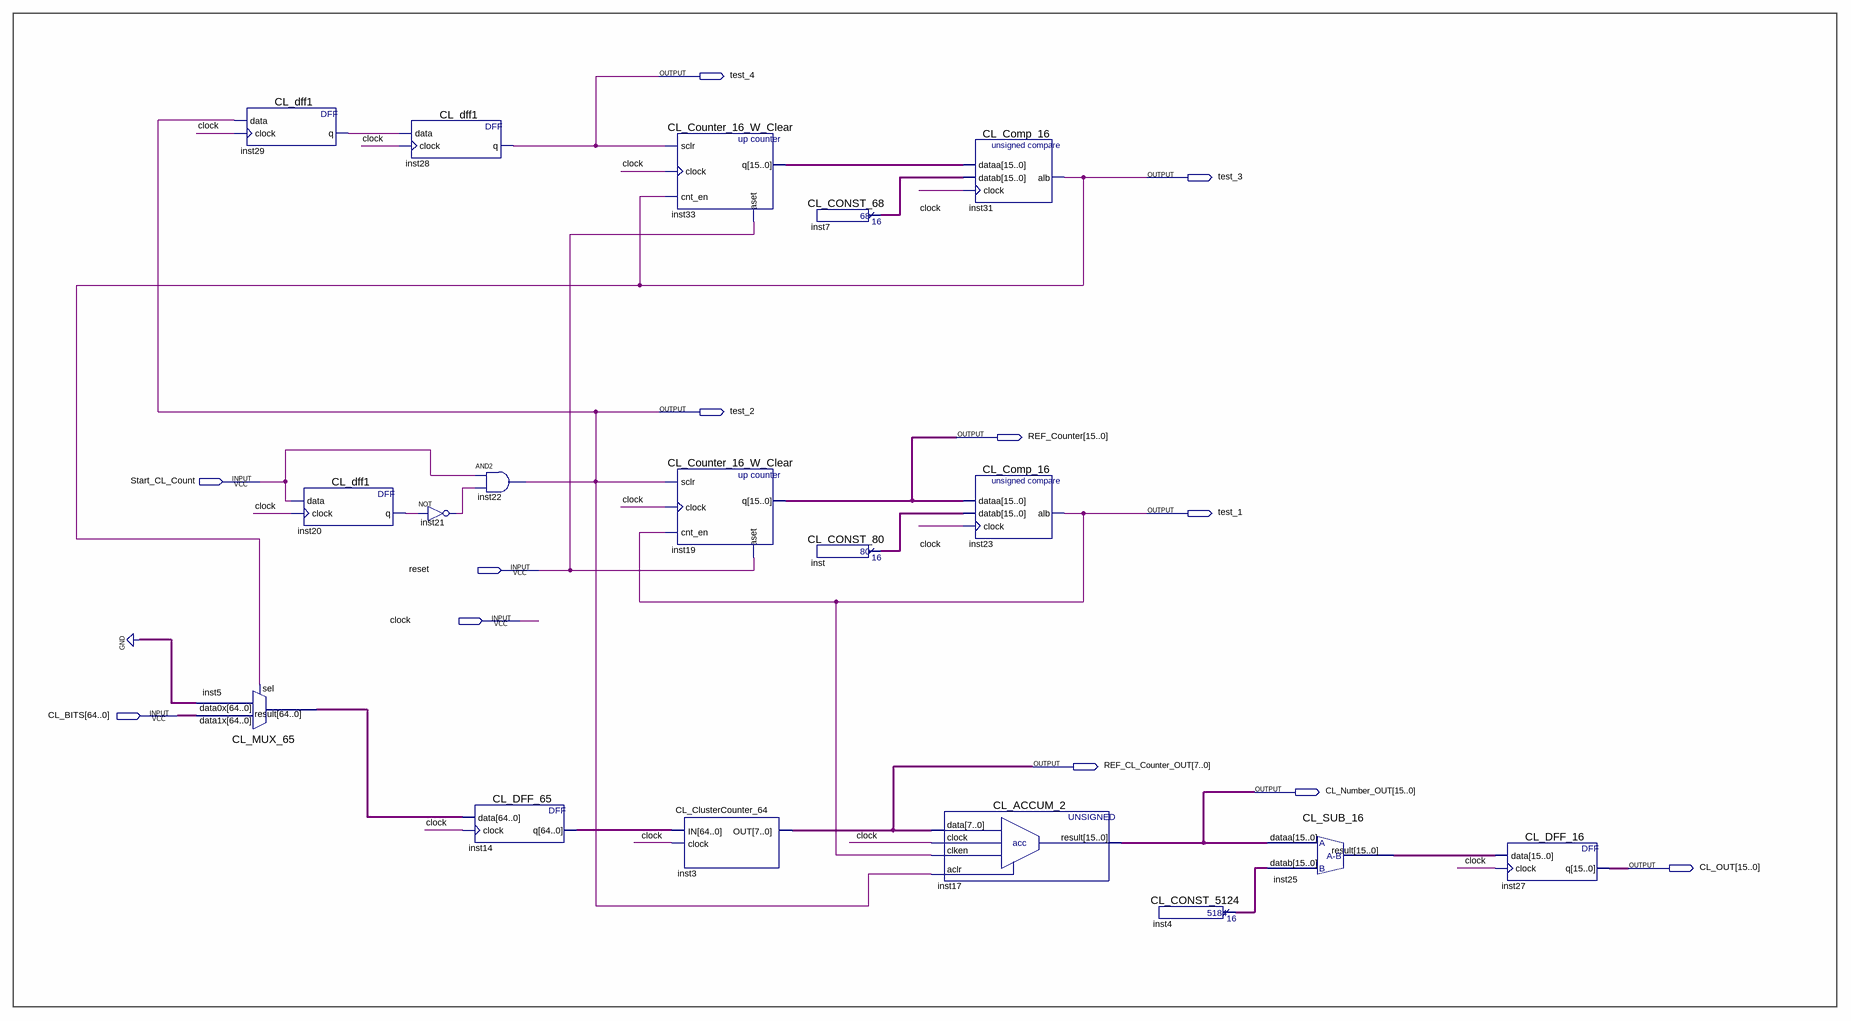
[diagram p0: schematic sheet]
// Quartus schematic CL_Block.bdf as structural Verilog: 18 symbols, 12 pins
module CL_Block (
  input  Start_CL_Count,
  input  reset,
  input  clock,
  input  [64:0] CL_BITS,
  output test_4,
  output test_3,
  output test_2,
  output [15:0] REF_Counter,
  output test_1,
  output [7:0] REF_CL_Counter_OUT,
  output [15:0] CL_Number_OUT,
  output [15:0] CL_OUT
);

  wire inst20_q, inst21_out, inst29_q;
  wire [15:0] inst4_result, inst7_result, inst25_result, inst33_q, inst_result;
  wire [64:0] inst5_result, inst14_q;

  CL_MUX_65 inst5 (.data1x(CL_BITS), .data0x({65{1'b0}}), .sel(test_3), .result(inst5_result));
  CL_dff1 inst29 (.data(test_2), .clock(clock), .q(inst29_q));
  CL_dff1 inst20 (.data(Start_CL_Count), .clock(clock), .q(inst20_q));
  CL_dff1 inst28 (.data(inst29_q), .clock(clock), .q(test_4));
  not inst21 (inst21_out, inst20_q);
  and inst22 (test_2, Start_CL_Count, inst21_out);
  CL_DFF_65 inst14 (.data(inst5_result), .clock(clock), .q(inst14_q));
  CL_Counter_16_W_Clear inst33 (.sclr(test_4), .clock(clock), .cnt_en(test_3), .aset(reset), .q(inst33_q));
  CL_Counter_16_W_Clear inst19 (.sclr(test_2), .clock(clock), .cnt_en(test_1), .aset(reset), .q(REF_Counter));
  CL_ClusterCounter_64 inst3 (.IN(inst14_q), .clock(clock), .OUT(REF_CL_Counter_OUT));
  CL_CONST_68 inst7 (.result(inst7_result));
  CL_CONST_80 inst (.result(inst_result));
  CL_ACCUM_2 inst17 (.data(REF_CL_Counter_OUT), .clock(clock), .clken(test_1), .aclr(test_2), .result(CL_Number_OUT));
  CL_Comp_16 inst31 (.dataa(inst33_q), .datab(inst7_result), .clock(clock), .alb(test_3));
  CL_Comp_16 inst23 (.dataa(REF_Counter), .datab(inst_result), .clock(clock), .alb(test_1));
  CL_CONST_5124 inst4 (.result(inst4_result));
  CL_SUB_16 inst25 (.dataa(CL_Number_OUT), .datab(inst4_result), .result(inst25_result));
  CL_DFF_16 inst27 (.data(inst25_result), .clock(clock), .q(CL_OUT));
endmodule
